# EAGLE design bluetooth (EAGLE 6.5.0)
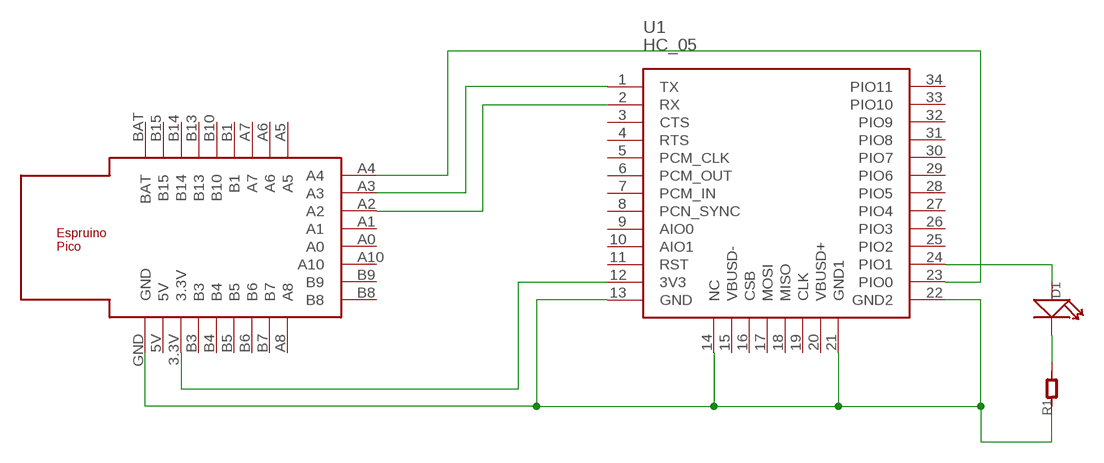
[diagram p0: schematic, sheet 1]

## Parts
D1  LED  [LED0603]
R1  R-0603  [R0603]
U1  HC_05  [BLUETOOTH_SMD]
U$1  ESPRUINO_PICO_SMDONLY  [ESPRUINO_PICO_SMDONLY]

## Nets
N$1: U1.12(3V3) U$1.3.3V
N$2: R1.1 U1.13(GND) U1.14(NC) U1.21(GND1) U1.22(GND2) U$1.GND
N$3: U1.1(TX) U$1.A3
N$4: U1.2(RX) U$1.A2
N$5: U1.23(PIO0) U$1.A4
N$6: D1.+ U1.24(PIO1)
N$7: D1.- R1.2
Unconnected: U1.3(CTS) U1.4(RTS) U1.5(PCM_CLK) U1.6(PCM_OUT) U1.7(PCM_IN) U1.8(PCN_SYNC) U1.9(AIO0) U1.10(AIO1) U1.11(RST) U1.15(VBUSD-) U1.16(CSB) U1.17(MOSI) U1.18(MISO) U1.19(CLK) U1.20(VBUSD+) U1.25(PIO2) U1.26(PIO3) U1.27(PIO4) U1.28(PIO5) U1.29(PIO6) U1.30(PIO7) U1.31(PIO8) U1.32(PIO9) U1.33(PIO10) U1.34(PIO11) U$1.5V U$1.A0 U$1.A1 U$1.A5 U$1.A6 U$1.A7 U$1.A8 U$1.A10 U$1.B1 U$1.B3 U$1.B4 U$1.B5 U$1.B6 U$1.B7 U$1.B8 U$1.B9 U$1.B10 U$1.B13 U$1.B14 U$1.B15 U$1.BAT

## Library data of the parts
D1 = OPL Eagle Library:LED*: LED
R1 = OPL Eagle Library:R*
U1 = bluetooth:HC_05
U$1 = espruino_pico:ESPRUINO_PICO_SMDONLY

## Net classes
0 default: width 0.305 mm

## Board
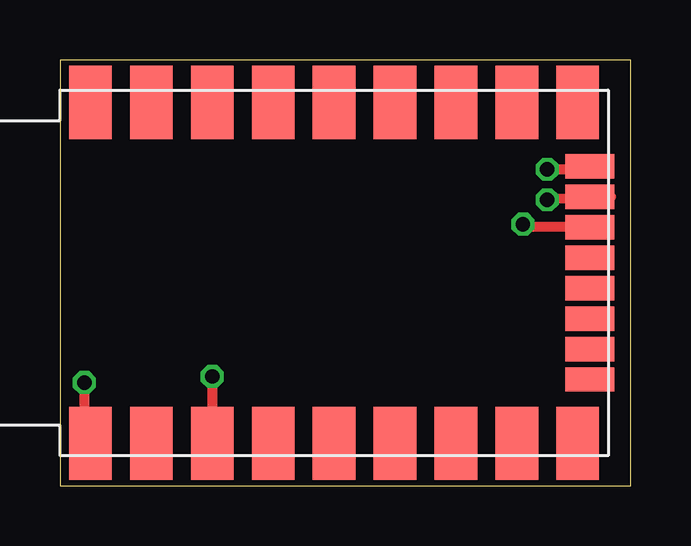
[diagram p1: board, top side]
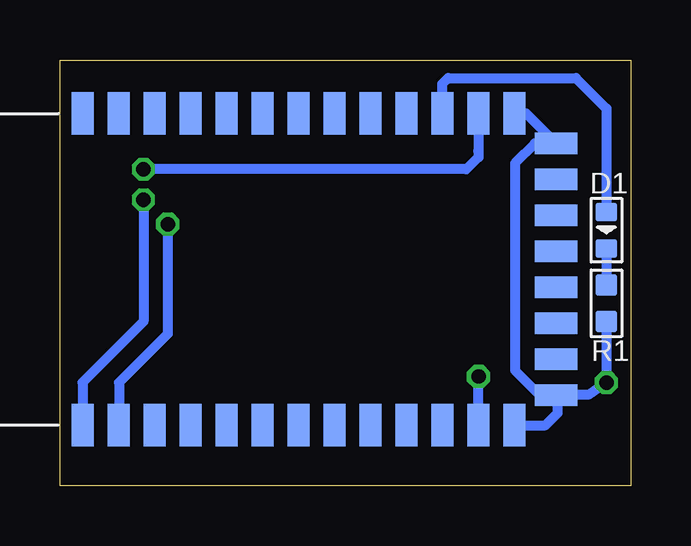
[diagram p2: board, bottom side, seen from below]

Size 23.8 x 17.77 mm. Coordinates in mm from the lower left corner, seen from the top.
Outline: 0,0 23.8,0 23.8,17.77 0,17.77 0,0
Copper layers (1*16): Top 0.0356mm / dielectric 1.5011mm / Bottom 0.0356mm
Design rules "oshpark": minimum track width 10mil, minimum drill 13mil, track to track 8mil, track to pad 6mil, pad to pad 6mil, via to via 6mil, smd to smd 6mil, copper to edge 15mil, drill to drill 6mil, minimum pad ring 7mil, minimum via ring 7mil, stop-mask expansion 4mil, vias tented up to drill 15mil, thermal gap 10mil

### Footprints (pad centres in the part's own frame; a part is rotated, then mirrored left to right if it is on the bottom)
LED0603 = smd 0.762 x 0.889: + -0.762,0; - 0.762,0
R0603 = smd 0.889 x 0.889: 1 -0.762,0; 2 0.762,0
BLUETOOTH_SMD = smd 1.778 x 0.914: 1 0,0; 2 0,-1.5; 3 0,-3; 4 0,-4.5; 5 0,-6; 6 0,-7.5; 7 0,-9; 8 0,-10.5; 9 0,-12; 10 0,-13.5; 11 0,-15; 12 0,-16.5; 13 0,-18; 22 13,-18; 23 13,-16.5; 24 13,-15; 25 13,-13.5; 26 13,-12; 27 13,-10.5; 28 13,-9; 29 13,-7.5; 30 13,-6; 31 13,-4.5; 32 13,-3; 33 13,-1.5; 34 13,0 | smd 0.914 x 1.778: 14 1.25,-19.75; 15 2.75,-19.75; 16 4.25,-19.75; 17 5.75,-19.75; 18 7.25,-19.75; 19 8.75,-19.75; 20 10.25,-19.75; 21 11.75,-19.75
ESPRUINO_PICO_SMDONLY = smd 1.778 x 3.048: 3.3V -8.89,-7.112; 5V -11.43,-7.112; A5 6.35,7.112; A6 3.81,7.112; A7 1.27,7.112; A8 6.35,-7.112; B1 -1.27,7.112; B3 -6.35,-7.112; B4 -3.81,-7.112; B5 -1.27,-7.112; B6 1.27,-7.112; B7 3.81,-7.112; B10 -3.81,7.112; B13 -6.35,7.112; B14 -8.89,7.112; B15 -11.43,7.112; BAT -13.97,7.112; GND -13.97,-7.112 | smd 2.032 x 1.016: A0 6.858,-0.635; A1 6.858,0.635; A2 6.858,1.905; A3 6.858,3.175; A4 6.858,4.445; A10 6.858,-1.905; B8 6.858,-4.445; B9 6.858,-3.175

### Placement (x,y rotation side)
D1  1.02,10.67 270 bottom
R1  1.02,7.62 90 bottom
U1  22.86,2.54 90 bottom
U$1  15.24,8.89 0 top

### Tracks (layer width: path | path; a pad name or v marks a point on that pad's centre or on a via)
N$1  (via drill 0.6)
  Top 0.406: v6.35,4.57 U$1.3.3V
  Bottom 0.406: U1.12 6.36,3.06 v6.35,4.57
N$2  (via drill 0.6)
  Top 0.406: v1.02,4.32 1.02,2.03 U$1.GND
  Bottom 0.406: R1.1 v1.02,4.32 1.78,3.81 3.09,3.81 U1.14 | U1.22 4.36,15.54 U1.21 4,14.29 4.83,13.46 4.83,4.83 3.81,3.81 3.13,3.81 U1.14 | U1.13 3.56,2.54 3.05,3.05 3.05,3.73 U1.14
N$3  (via drill 0.6)
  Top 0.406: U$1.A3 22.99,12.06 v20.32,11.94
  Bottom 0.406: 23.11,2.79 U1.1 22.86,4.32 20.32,6.86 v20.32,11.94
N$4  (via drill 0.6)
  Top 0.406: U$1.A2 19.43,10.79 v19.3,10.92
  Bottom 0.406: v19.3,10.92 19.3,6.35 21.34,4.32 21.34,2.56 U1.2
N$5  (via drill 0.6)
  Top 0.406: v20.32,13.21 22.23,13.21 U$1.A4
  Bottom 0.406: U1.23 6.36,13.98 6.35,13.97 6.35,13.72 6.86,13.21 v20.32,13.21
N$6
  Bottom 0.406: U1.24 7.86,16.78 7.62,17.02 2.29,17.02 1.02,15.75 D1.+
N$7
  Bottom 0.406: D1.- R1.2